# EasyEDA Pro project 电压表-TP2582_SR.eprj

# Schematic Schematic1
Board Name: Board1; Create Date: 2025-01-14; Page Name: P1; Project Name: 电压表-TP2582_SR; Schematic Name: Schematic1; Update Date: 2025-11-15; Company: 广东石油化工电子信息工程学院; Drawed: LMH; Page Size: A4; Version: V1.0
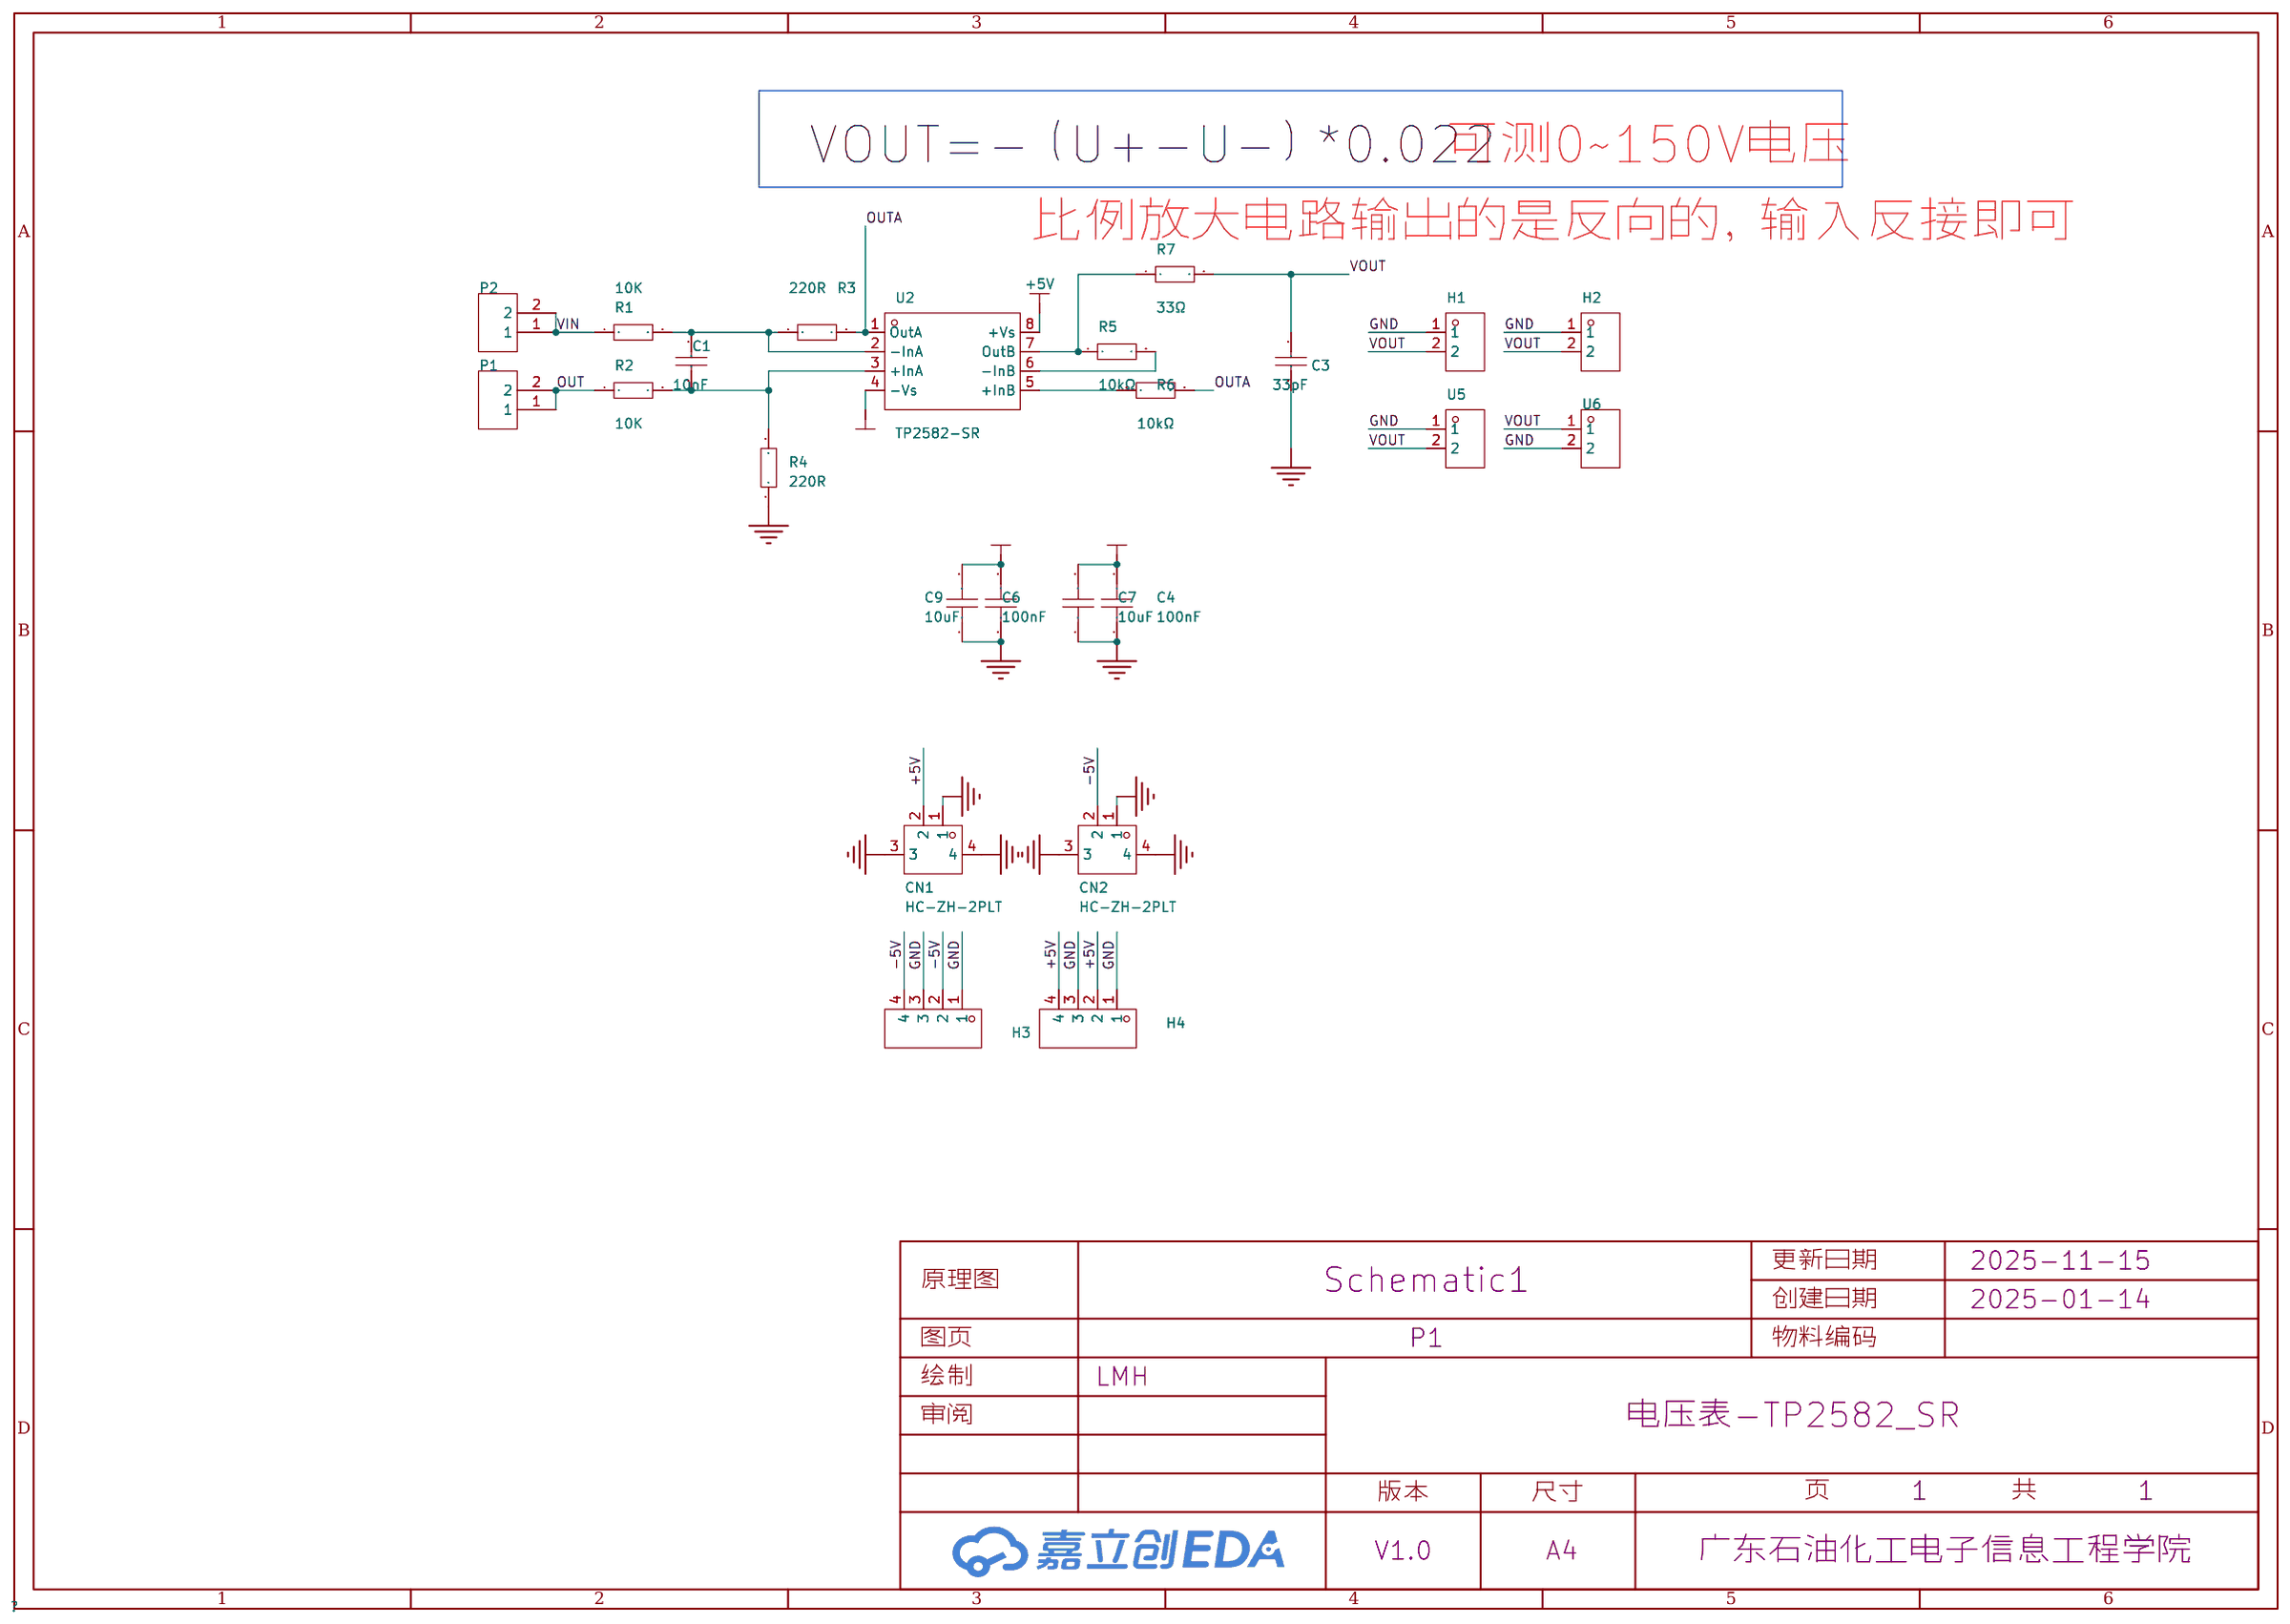
[diagram p0: schematic sheet]

## Parts
C1  10nF  [C0805]
C3  33pF  [C0805]
C4  100nF  [C0805]
C6  100nF  [C0805]
C7  10uF  [C0805]
C9  10uF  [C0805]
CN1  HC-ZH-2PLT  [CONN-SMD_2P-P1.5_HCTL_HC-ZH-2PLT]
CN2  HC-ZH-2PLT  [CONN-SMD_2P-P1.5_HCTL_HC-ZH-2PLT]
H1  PZ254V-11-02P  [HDR-TH_2P-P2.54-V-M]
H2  PZ254V-11-02P  [HDR-TH_2P-P2.54-V-M]
H3  PZ254V-11-04P  [HDR-TH_4P-P2.54-V-M]
H4  PZ254V-11-04P  [HDR-TH_4P-P2.54-V-M]
P1  WJ500V-5.08-2P  [CONN-TH_2P-P5.00_WJ500V-5.08-2P]
P2  WJ500V-5.08-2P  [CONN-TH_2P-P5.00_WJ500V-5.08-2P]
R1  10K  [R0805]
R2  10K  [R0805]
R3  220R  [R0805]
R4  220R  [R0805]
R5  10kΩ  [R0805]
R6  10kΩ  [R0805]
R7  33Ω  [R0805]
U2  TP2582-SR  [SOIC-8_L4.9-W3.9-P1.27-LS6.0-BL]
U5  DB125-2.54-2P-GN-S  [CONN-TH_DB125-2.54-2P-GN]
U6  DB125-2.54-2P-GN-S  [CONN-TH_DB125-2.54-2P-GN]

## Library data of the parts
C1 = CL21B103KBANNNC: 容值:10nF;精度:±10%;额定电压:50V;材质(温度系数):X7R;; LCSC Part Name: 10nF ±10% 50V; Supplier Part: C1710; Manufacturer: SAMSUNG(三星); Supplier Footprint: 0805; JLCPCB Part Class: 基础库; Datasheet: https://atta.szlcsc.com/upload/public/pdf/source/20160218/1457707763339.pdf; Supplier: LCSC; Tolerance: ±10%; Voltage Rated: 50V; Temperature Coefficient: X7R
C3 = CC0805JRNPO9BN330: 容值:33pF;精度:±5%;额定电压:50V;材质(温度系数):NP0;; LCSC Part Name: 33pF ±5% 50V; Supplier Part: C107115; Manufacturer: YAGEO(国巨); Supplier Footprint: 0805; JLCPCB Part Class: 扩展库; Datasheet: https://atta.szlcsc.com/upload/public/pdf/source/20170914/C128857_1505359892143968080.pdf; Supplier: LCSC; Tolerance: ±5%; Voltage Rated: 50V; Temperature Coefficient: NP0
C4 C6 = CC0805KRX7R9BB104: 容值:100nF;精度:±10%;额定电压:50V;材质(温度系数):X7R;; LCSC Part Name: 100nF ±10% 50V; Supplier Part: C49678; Manufacturer: YAGEO(国巨); Supplier Footprint: 0805; JLCPCB Part Class: 基础库; Datasheet: https://atta.szlcsc.com/upload/public/pdf/source/20180224/C181747_15194369449651363981.pdf; Supplier: LCSC; Tolerance: ±10%; Voltage Rated: 50V; Temperature Coefficient: X7R
C7 C9 = GRM21BR61H106KE43L: 容值:10uF;精度:±10%;额定电压:50V;材质(温度系数):X5R;; LCSC Part Name: 10uF ±10% 50V; Supplier Part: C440198; Manufacturer: muRata(村田); Supplier Footprint: 0805; JLCPCB Part Class: 基础库; Datasheet: https://atta.szlcsc.com/upload/public/pdf/source/20230811/95AAE0C9AF55EDC31B7A4D8B733F534E.pdf; Supplier: LCSC; Tolerance: ±10%; Voltage Rated: 50V; Temperature Coefficient: X5R
CN1 CN2 = HC-ZH-2PLT: 插针结构:1x2P;间距:1.5mm;安装方式:立贴;参考系列:ZH;总PIN数:2P;排数:1;每排PIN数:2;行距:-;额定电流:1A;触头材质:黄铜;触头镀层:锡;工作温度范围:-25℃~+85℃;; LCSC Part Name: 1x2P 间距:1.5mm 立贴 系列:ZH; Supplier Part: C2845433; Manufacturer: HCTL(华灿天禄); Supplier Footprint: SMD,P=1.5mm; JLCPCB Part Class: 扩展库; Datasheet: https://atta.szlcsc.com/upload/public/pdf/source/20230711/D81FF332C15C8E2E9B4D7A4F08ACC3E8.pdf; Supplier: LCSC; Pins Structure: 1x2P; Pitch: 1.5mm; Mounting Style: 立贴; Reference Series: ZH; Number of Pins: 2P; Number of Rows: 1; Number of PINs Per Row: 2; Current Rating (Max): 1A; Contact Material: 黄铜; Contact Plating: 锡; Operating Temperature Range: -25℃~+85℃; Rated Voltage (Max): 100V; Plastic Material: PA6T; Flame Retardant Rating: UL94V-0; Supplementary Features: 辅助焊脚; Z-Height of the Board: 5.1mm; X-Length of Bottom Edge on Board (Spacing Line): 6mm; Y-Width of Bottom Edge on Board: 5.2mm
H1 H2 = PZ254V-11-02P: 插针结构:1x2P;间距:2.54mm;行距:-;圆针/方针:方针;安装类型:直插;排数:单排;总PIN位数:2P;额定电流:-;额定电压:-;配合针长度:6mm;塑高:2.5mm;端接针长度:3mm;触头材质:黄铜;触头镀层:-;工作温度范围:-40℃~+105℃;颜色:黑色;; LCSC Part Name: 间距:2.54mm 1x2P 直插 方针; Supplier Part: C492401; Manufacturer: XFCN(兴飞); Supplier Footprint: 插件,P=2.54mm; JLCPCB Part Class: 扩展库; Datasheet: https://atta.szlcsc.com/upload/public/pdf/source/20200309/C492401_A812433581A9B211A7FFA413ADDFF0E5.pdf; Supplier: LCSC; Pin Structure: 1x2P; Pitch: 2.54mm; Circluar Pins/Square Pins: 方针; Mounting Type: 直插; Number of Rows: 单排; Number of Pins: 2P; Length of Mating Pin: 6mm; Insulation Height: 2.5mm; Length of End Connection Pin: 3mm; Contact Material: 黄铜; Operating Temperature Range: -40℃~+105℃; Color: 黑色
H3 H4 = PZ254V-11-04P: 插针结构:1x4P;间距:2.54mm;行距:-;圆针/方针:方针;安装类型:直插;排数:单排;总PIN位数:4P;额定电流:3A;额定电压:250V;配合针长度:6mm;塑高:2.5mm;端接针长度:3mm;触头材质:-;工作温度范围:-40℃~+105℃;颜色:黑色;; LCSC Part Name: 间距:2.54mm 1x4P 直插 方针; Supplier Part: C2691448; Manufacturer: XFCN(兴飞); Supplier Footprint: 插件,P=2.54mm; JLCPCB Part Class: 扩展库; Datasheet: https://atta.szlcsc.com/upload/public/pdf/source/20200309/C492403_F9F19131791D08044AD4F84F8E751A34.pdf; Supplier: LCSC; Pin Structure: 1x4P; Pitch: 2.54mm; Circluar Pins/Square Pins: 方针; Mounting Type: 直插; Number of Rows: 单排; Number of Pins: 4P; Current Rating (Max): 3A; Voltage Rating (Max): 250V; Length of Mating Pin: 6mm; Insulation Height: 2.5mm; Length of End Connection Pin: 3mm; Operating Temperature Range: -40℃~+105℃; Color: 黑色
P1 P2 = WJ500V-5.08-2P: 结构:1x2P;间距:5.08mm;颜色:绿色;安装方式:直插;额定电流:18A;额定电压:250V;排数:1;线规 - AWG:14~30;线规 - 平方毫米:2.5;每排PIN数:2;触头材质:-;触头镀层:-;工作温度范围:-40℃~+105℃;焊接温度(最大值):-;; LCSC Part Name: 1x2P 5.08mm 直插 排数:1 每排P数:2; Supplier Part: C8465; Manufacturer: KANGNEX(康奈克斯电气); Supplier Footprint: 插件,P=5.08mm; JLCPCB Part Class: 扩展库; Datasheet: https://atta.szlcsc.com/upload/public/pdf/source/20191225/C8465_02D34CE5B5B4A53DF5891601D97FA9F4.pdf; Supplier: LCSC; Structure: 1x2P; Pitch: 5.08mm; Color: 绿色; Mounting Style: 直插; Current Rating (Max): 18A; Voltage Rating (Max): 250V; Number of Pins: 2P; Number of Rows: 1; Wire Gauge - AWG: 14~30; Wire Gauge - mm2: 2.5; Number of PINs Per Row: 2; Operating Temperature Range: -40℃~+105℃; Screw Specification: M2.5
R1-R4 = 0805W8F2002T5E: 电阻类型:厚膜电阻;阻值:20kΩ;精度:±1%;功率:125mW;最大工作电压:150V;温度系数:±100ppm/℃;; LCSC Part Name: 20kΩ ±1% 125mW 厚膜电阻; Supplier Part: C4328; Manufacturer: UNI-ROYAL(厚声); Supplier Footprint: 0805; JLCPCB Part Class: 基础库; Datasheet: https://atta.szlcsc.com/upload/public/pdf/source/20200306/C422600_1E6D84923E4A46A82E41ADD87F860B5C.pdf; Supplier: LCSC; Type: 厚膜电阻; Tolerance: ±1%; Power(Watts): 125mW; Overload Voltage (Max): 150V; Temperature Coefficient: ±100ppm/℃; Operating Temperature Range: -55℃~+155℃
R5 R6 = 0805W8F1002T5E_C17414: 电阻类型:厚膜电阻;阻值:10kΩ;精度:±1%;功率:125mW;最大工作电压:150V;温度系数:±100ppm/℃;; LCSC Part Name: 10kΩ ±1% 125mW 厚膜电阻; Supplier Part: C17414; Manufacturer: UNI-ROYAL(厚声); Manufacturer Part: 0805W8F1002T5E; Supplier Footprint: 0805; JLCPCB Part Class: 基础库; Datasheet: https://atta.szlcsc.com/upload/public/pdf/source/20200306/C422600_1E6D84923E4A46A82E41ADD87F860B5C.pdf; Supplier: LCSC; Type: 厚膜电阻; Tolerance: ±1%; Power(Watts): 125mW; Overload Voltage (Max): 150V; Temperature Coefficient: ±100ppm/℃; Operating Temperature Range: -55℃~+155℃
R7 = 0805W8F330JT5E: 电阻类型:厚膜电阻;阻值:33Ω;精度:±1%;功率:125mW;最大工作电压:150V;温度系数:±200ppm/℃;; LCSC Part Name: 33Ω ±1% 125mW 厚膜电阻; Supplier Part: C17634; Manufacturer: UNI-ROYAL(厚声); Supplier Footprint: 0805; JLCPCB Part Class: 基础库; Datasheet: https://atta.szlcsc.com/upload/public/pdf/source/20200306/C422600_1E6D84923E4A46A82E41ADD87F860B5C.pdf; Supplier: LCSC; Type: 厚膜电阻; Tolerance: ±1%; Power(Watts): 125mW; Overload Voltage (Max): 150V; Temperature Coefficient: ±200ppm/℃; Operating Temperature Range: -55℃~+155℃
U2 = TP2582-SR: 放大器数:双路;轨到轨:轨到轨输入,轨到轨输出;增益带宽积(GBP):10MHz;输入失调电压(Vos):3mV;压摆率(SR):8V/us;; Supplier Part: C2902353; Manufacturer: 3PEAK(思瑞浦); Supplier Footprint: SOIC-8; JLCPCB Part Class: 扩展库; Datasheet: https://atta.szlcsc.com/upload/public/pdf/source/20211223/515281FEBBDAE01F601176C373C89B30.pdf; Supplier: LCSC; Number of Circuits: 双路; Maximum Power Supply Range (Vdd-Vss): 36V; Rail to Rail: 轨到轨输入,轨到轨输出; Gain Bandwidth Product(GBP): 10MHz; Voltage - Input Offset(Vos): 3mV; Input Offset Voltage Drift (Vos TC): 2uV/℃; Slew Rate(SR): 8V/us; Noise density(eN): 17nV/√Hz@10kHz; Common Mode Rejection Ratio (CMRR): 130dB; Operating Temperature: -40℃~+125℃
U5 U6 = DB125-2.54-2P-GN-S: 结构:1x2P;间距:2.54mm;颜色:绿色;安装方式:直插;额定电流:8A;额定电压:130V;排数:1;线规 - AWG:18~26;线规 - 平方毫米:0.5~1;每排PIN数:2;工作温度范围:-40℃~+105℃;; LCSC Part Name: 2.54mm 1x2P 排数:1 每排P数:2 直插; Supplier Part: C918120; Manufacturer: DORABO(地博电气); Supplier Footprint: 插件,P=2.54mm; JLCPCB Part Class: 扩展库; Datasheet: https://atta.szlcsc.com/upload/public/pdf/source/20230106/BCD3A0BE1EB95DC3E813F1745F022035.pdf; Supplier: LCSC; Structure: 1x2P; Pitch: 2.54mm; Color: 绿色; Mounting Style: 直插; Current Rating (Max): 8A; Voltage Rating (Max): 130V; Number of Pins: 2P; Number of Rows: 1; Wire Gauge - AWG: 18~26; Wire Gauge - mm2: 0.5~1; Number of PINs Per Row: 2; Operating Temperature Range: -40℃~+105℃

## Nets
+5V: C4.2 C7.2 CN1.2 H4.2 H4.4 U2.8(+Vs)
-5V: C6.2 C9.2 CN2.2 H3.2 H3.4 U2.4(-Vs)
GND: C3.1 C4.1 C6.1 C7.1 C9.1 CN1.1 CN1.3 CN1.4 CN2.1 CN2.3 CN2.4 H1.1 H2.1 H3.1 H3.3 H4.1 H4.3 R4.1 U5.1 U6.2
VIN: P2.1 P2.2 R1.1
OUT: P1.1 P1.2 R2.1
OUTA: R3.2 R6.2 U2.1(OutA)
VOUT: C3.2 H1.2 H2.2 R7.2 U5.2 U6.1
$1N1433: C1.1 R2.2 R4.2 U2.3(+InA)
$1N1434: C1.2 R1.2 R3.1 U2.2(-InA)
$1N1437: R6.1 U2.5(+InB)
$1N1440: R5.2 U2.6(-InB)
$1N1441: R5.1 R7.1 U2.7(OutB)

## Notes on the sheet
- VOUT=-（U+-U-）*0.022
- 可测0~150V电压
- 比例放大电路输出的是反向的，输入反接即可

# Board PCB1
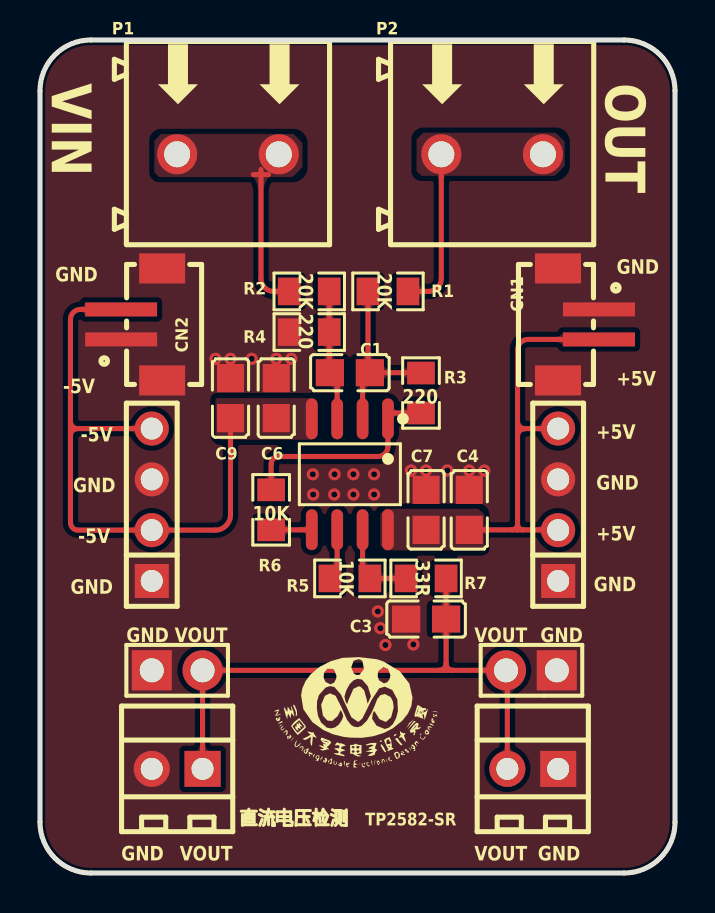
[diagram p1: board, top side]
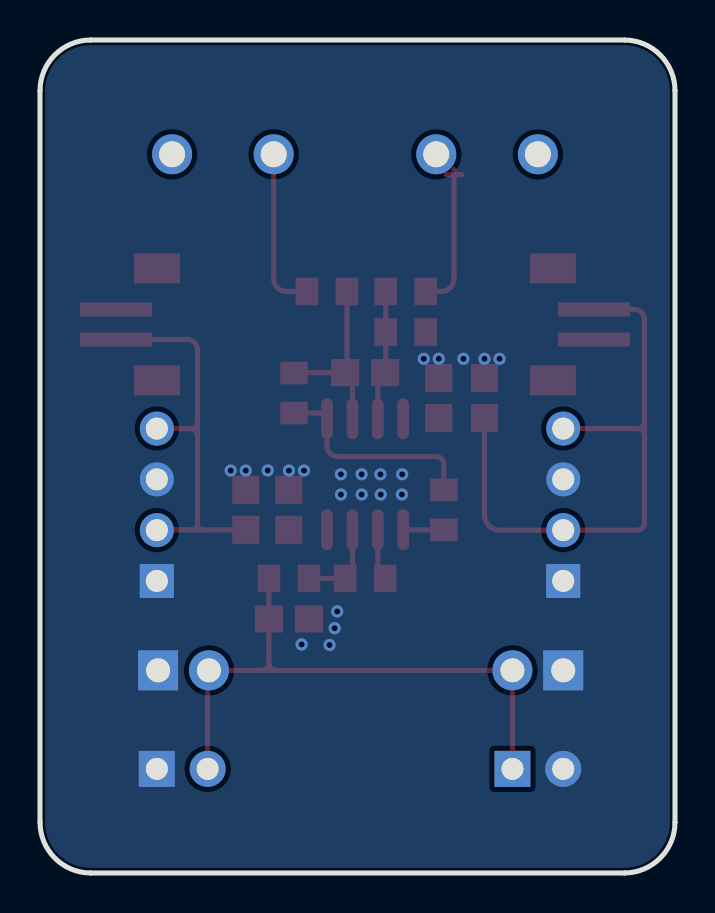
[diagram p2: board, bottom side, seen from below]

Outline 31.75 x 41.66 mm; copper layers: Top Layer, Bottom Layer. Coordinates in mm from the lower left corner of the outline.
Outline path: 0,39.12 0,2.54 arc(0.74,0.74) 2.54,0 29.21,0 arc(31.01,0.74) 31.75,2.54 31.75,39.12 arc(31.01,40.91) 29.21,41.66 2.54,41.66 arc(0.74,40.91) 0,39.12
Stack: Top Layer 0.035mm / Dielectric1 1.51mm FR4 er 4.5 / Bottom Layer 0.035mm

## Design rules (mm)
template: 自定义配置
spacing copperThickness1oz (default): track to track 0.102, other pairs 0.152 to 0.3
spacing copperThickness2oz: track to track 0.203, other pairs 0.152 to 0.3
track width copperThickness1oz (default): min 0.127, default 0.254, max 2.54
track width copperThickness2oz: min 0.203, default 0.254, max 2.54
differential pair differentialPair (default): width min 0.127, default 0.254, max 2.54; gap min 0.152, default 0.152
via viaSize (default): diameter min 0.5, default 0.61, max 10; hole min 0.3, default 0.305, max 6.3
pour e359 uses copperRegion

## Placement (name value [footprint] x y rotation side)
C1  10nF  [C0805]  15.49 25.02 0 top
C3  33pF  [C0805]  19.3 12.7 0 top
C4  100nF  [C0805]  21.46 18.16 270 top
C6  100nF  [C0805]  11.81 23.75 270 top
C7  10uF  [C0805]  19.3 18.16 270 top
C9  10uF  [C0805]  9.53 23.75 270 top
CN1  HC-ZH-2PLT  [CONN-SMD_2P-P1.5_HCTL_HC-ZH-2PLT]  26.92 27.43 270 top
CN2  HC-ZH-2PLT  [CONN-SMD_2P-P1.5_HCTL_HC-ZH-2PLT]  5.08 27.43 90 top
H1  PZ254V-11-02P  [HDR-TH_2P-P2.54-V-M]  6.86 10.14 0 top
H2  PZ254V-11-02P  [HDR-TH_2P-P2.54-V-M]  24.57 10.14 180 top
H3  PZ254V-11-04P  [HDR-TH_4P-P2.54-V-M]  5.59 18.41 90 top
H4  PZ254V-11-04P  [HDR-TH_4P-P2.54-V-M]  25.91 18.41 90 top
P1  WJ500V-5.08-2P  [CONN-TH_2P-P5.00_WJ500V-5.08-2P]  9.4 35.94 0 top
P2  WJ500V-5.08-2P  [CONN-TH_2P-P5.00_WJ500V-5.08-2P]  22.61 35.94 0 top
R1  10K  [R0805]  17.4 29.08 180 top
R2  10K  [R0805]  13.46 29.08 0 top
R3  220R  [R0805]  19.05 24 270 top
R4  220R  [R0805]  13.46 27.05 0 top
R5  10kΩ  [R0805]  15.49 14.73 180 top
R6  10kΩ  [R0805]  11.56 18.16 90 top
R7  33Ω  [R0805]  19.3 14.73 0 top
U2  TP2582-SR  [SOIC-8_L4.9-W3.9-P1.27-LS6.0-BL]  15.49 19.94 180 top
U5  DB125-2.54-2P-GN-S  [CONN-TH_DB125-2.54-2P-GN]  24.64 5.21 180 top
U6  DB125-2.54-2P-GN-S  [CONN-TH_DB125-2.54-2P-GN]  6.86 5.21 180 top

## Footprints (pads in the part's own frame, mm; a bottom-side part is the same pattern mirrored in y, then rotated)
C0805
  rect 1.41x1.35 smd: 1(-1,0) 2(1,0)
CONN-SMD_2P-P1.5_HCTL_HC-ZH-2PLT
  rect 0.7x3.6 smd: 1(-0.75,1.025) 2(0.75,1.025)
  rect 1.5x2.3 smd: 3(-2.8,-1.025) 4(2.8,-1.025)
CONN-TH_2P-P5.00_WJ500V-5.08-2P
  round 2 hole 1.3: 1(-2.54,0) 2(2.54,0)
CONN-TH_DB125-2.54-2P-GN
  rect 1.8x1.8 hole 1.1: 1(-1.27,0)
  round 1.8 hole 1.1: 2(1.27,0)
HDR-TH_2P-P2.54-V-M
  rect 2x2 hole 1.2: 1(-1.27,0)
  round 2 hole 1.2: 2(1.27,0)
HDR-TH_4P-P2.54-V-M
  rect 1.7x1.7 hole 1.1: 1(-3.81,0)
  round 1.7 hole 1.1: 2(-1.27,0) 3(1.27,0) 4(3.81,0)
R0805
  rect 1.133x1.377 smd: 1(-1,0) 2(1,0)
SOIC-8_L4.9-W3.9-P1.27-LS6.0-BL
  oval 0.588x2.045 smd: 1(-1.905,-2.772) 2(-0.635,-2.772) 3(0.635,-2.772) 4(1.905,-2.772) 5(1.905,2.772) 6(0.635,2.772) 7(-0.635,2.772) 8(-1.905,2.772)

## Nets
As in the schematic.

## Via types
v1: diameter 0.61, hole 0.305, Top Layer to Bottom Layer, 22 vias

## Routing (per net, layer and track width the routed paths; a pad name or vN(x,y) marks a point on that pad's centre or on a via; arc(x,y) is an arc through that point)
+5V: length 21.9
  Top Layer w0.254: 23.88,17.44 23.88,17.2 arc(23.87,17.17) 23.84,17.16 ; 23.88,17.44 23.88,21.84 ; 23.88,17.44 arc(23.79,17.24) 23.59,17.16 ; 23.88,17.44 arc(23.96,17.24) 24.16,17.16 ; 24.16,17.16 25.89,17.16 arc(25.9,17.16) H4.2 ; 24.16,17.16 23.84,17.16 ; 23.88,21.84 23.88,22.2 ; 23.88,21.84 arc(23.99,22.11) 24.26,22.22 ; 24.23,22.22 24.26,22.22 ; 24.23,22.22 23.9,22.22 arc(23.88,22.22) 23.88,22.2 ; 24.23,22.22 arc(23.98,22.33) 23.88,22.58 ; 24.26,22.22 H4.4 ; 23.84,17.16 23.59,17.16 ; 23.88,22.2 23.88,22.58 ; CN1.2 24.4,26.68 arc(24.03,26.53) 23.88,26.16 23.88,22.58 ; C4.2 23.59,17.16
-5V: length 31.6
  Top Layer w0.254: H3.4 1.87,22.22 arc(1.62,22.33) 1.52,22.57 ; 1.52,22.57 1.52,22.22 ; 1.52,22.57 1.52,27.69 arc(1.67,28.04) 2.02,28.18 CN2.2 ; 1.52,22.22 1.87,22.22 arc(1.62,22.13) 1.52,21.88 ; 1.52,22.22 1.52,21.88 ; C9.2 9.53,17.91 arc(9.3,17.37) 8.76,17.14 H3.2 1.91,17.14 arc(1.64,17.26) 1.52,17.53 1.52,21.88
GND:
  vias: v1(8.77,25.71) v1(9.53,25.71) v1(10.58,25.71) v1(11.81,25.71) v1(12.56,25.71) v1(13.64,19.94) v1(13.66,18.93) v1(14.73,19.94) v1(14.71,18.93) v1(15.67,19.94) v1(15.67,18.93) v1(16.71,19.94) v1(16.71,18.93) v1(16.89,13.08) v1(17.02,12.24) v1(17.27,11.4) v1(18.55,20.12) v1(18.67,11.43) v1(19.3,20.12) v1(20.37,20.13) v1(21.46,20.12) v1(22.21,20.12)
VIN: length 8.3
  Top Layer w0.254: P2.1 20.07,29.72 arc(19.88,29.27) 19.43,29.08 R1.1
OUT: length 8
  Top Layer w0.254: 10.67,34.92 11.05,34.92 ; 11.05,34.92 11.05,29.72 arc(11.23,29.27) 11.68,29.08 R2.1 ; 11.05,34.92 11.43,34.92 ; 11.05,34.92 11.05,35.18
OUTA: length 10.8
  Top Layer w0.254: R6.2 11.56,20.45 arc(11.67,20.72) 11.94,20.83 16.89,20.83 arc(17.25,20.98) 17.4,21.34 U2.1 arc(17.48,22.92) 17.69,23 R3.2
VOUT: length 30.7
  Top Layer w0.254: U5.2 23.37,10.07 H2.2 20.64,10.14 ; U6.1 H1.2 19.97,10.14 ; 20.29,10.14 20.3,10.15 20.3,10.47 ; 20.29,10.14 20.64,10.14 ; 20.29,10.14 19.97,10.14 ; 20.3,10.47 C3.2 R7.2 ; 20.3,10.47 arc(20.4,10.23) 20.64,10.14 ; 20.3,10.47 arc(20.21,10.23) 19.97,10.14
$1N1433: length 6.5
  Top Layer w0.254: U2.3 14.86,24.65 C1.1 arc(14.47,25.03) 14.46,25.05 R4.2 R2.2
$1N1434: length 9.1
  Top Layer w0.254: C1.2 19.03,25.02 arc(19.05,25.01) R3.1 ; C1.2 16.13,24.65 U2.2 ; C1.2 arc(16.43,25.05) 16.4,25.11 R1.2
$1N1437: length 2
  Top Layer w0.254: R6.1 13.58,17.16 arc(13.59,17.16) U2.5
$1N1440: length 2.6
  Top Layer w0.254: U2.6 14.86,15.1 R5.2
$1N1441: length 4.4
  Top Layer w0.254: U2.7 16.13,15.1 R5.1 R7.1

## Copper pours and planes (outline as drawn; the poured copper is in the pictures)
+5V on Top Layer: 17.02,18.21 22.21,18.21 22.21,16.13 17.02,16.13
-5V on Top Layer: 8.77,23.75 13.84,23.75 13.84,21.66 8.77,21.66
GND on Top Layer: -1.65,43.43 33.15,43.43 33.15,-2.16 -1.65,-2.16
GND on Bottom Layer: -2.16,45.34 33.4,45.34 33.4,-2.03 -2.16,-2.03
VIN on Top Layer: 18.83,37.02 26.24,37.02 26.24,34.86 18.83,34.86
OUT on Top Layer: 5.72,36.96 13.12,36.96 13.12,34.8 5.72,34.8

Small or netless copper shapes (teardrops, artwork), in the pictures only: 49 on Top Layer

## Text on the board
Top Silkscreen Layer: TP2582-SR | GND | -5V | VOUT | +5V | 10K | 220 | 20K | 33R | VIN | OUT | 直流电压检测
